# EAGLE schematic talkie_module_panel_1 (EAGLE 7.1.0)
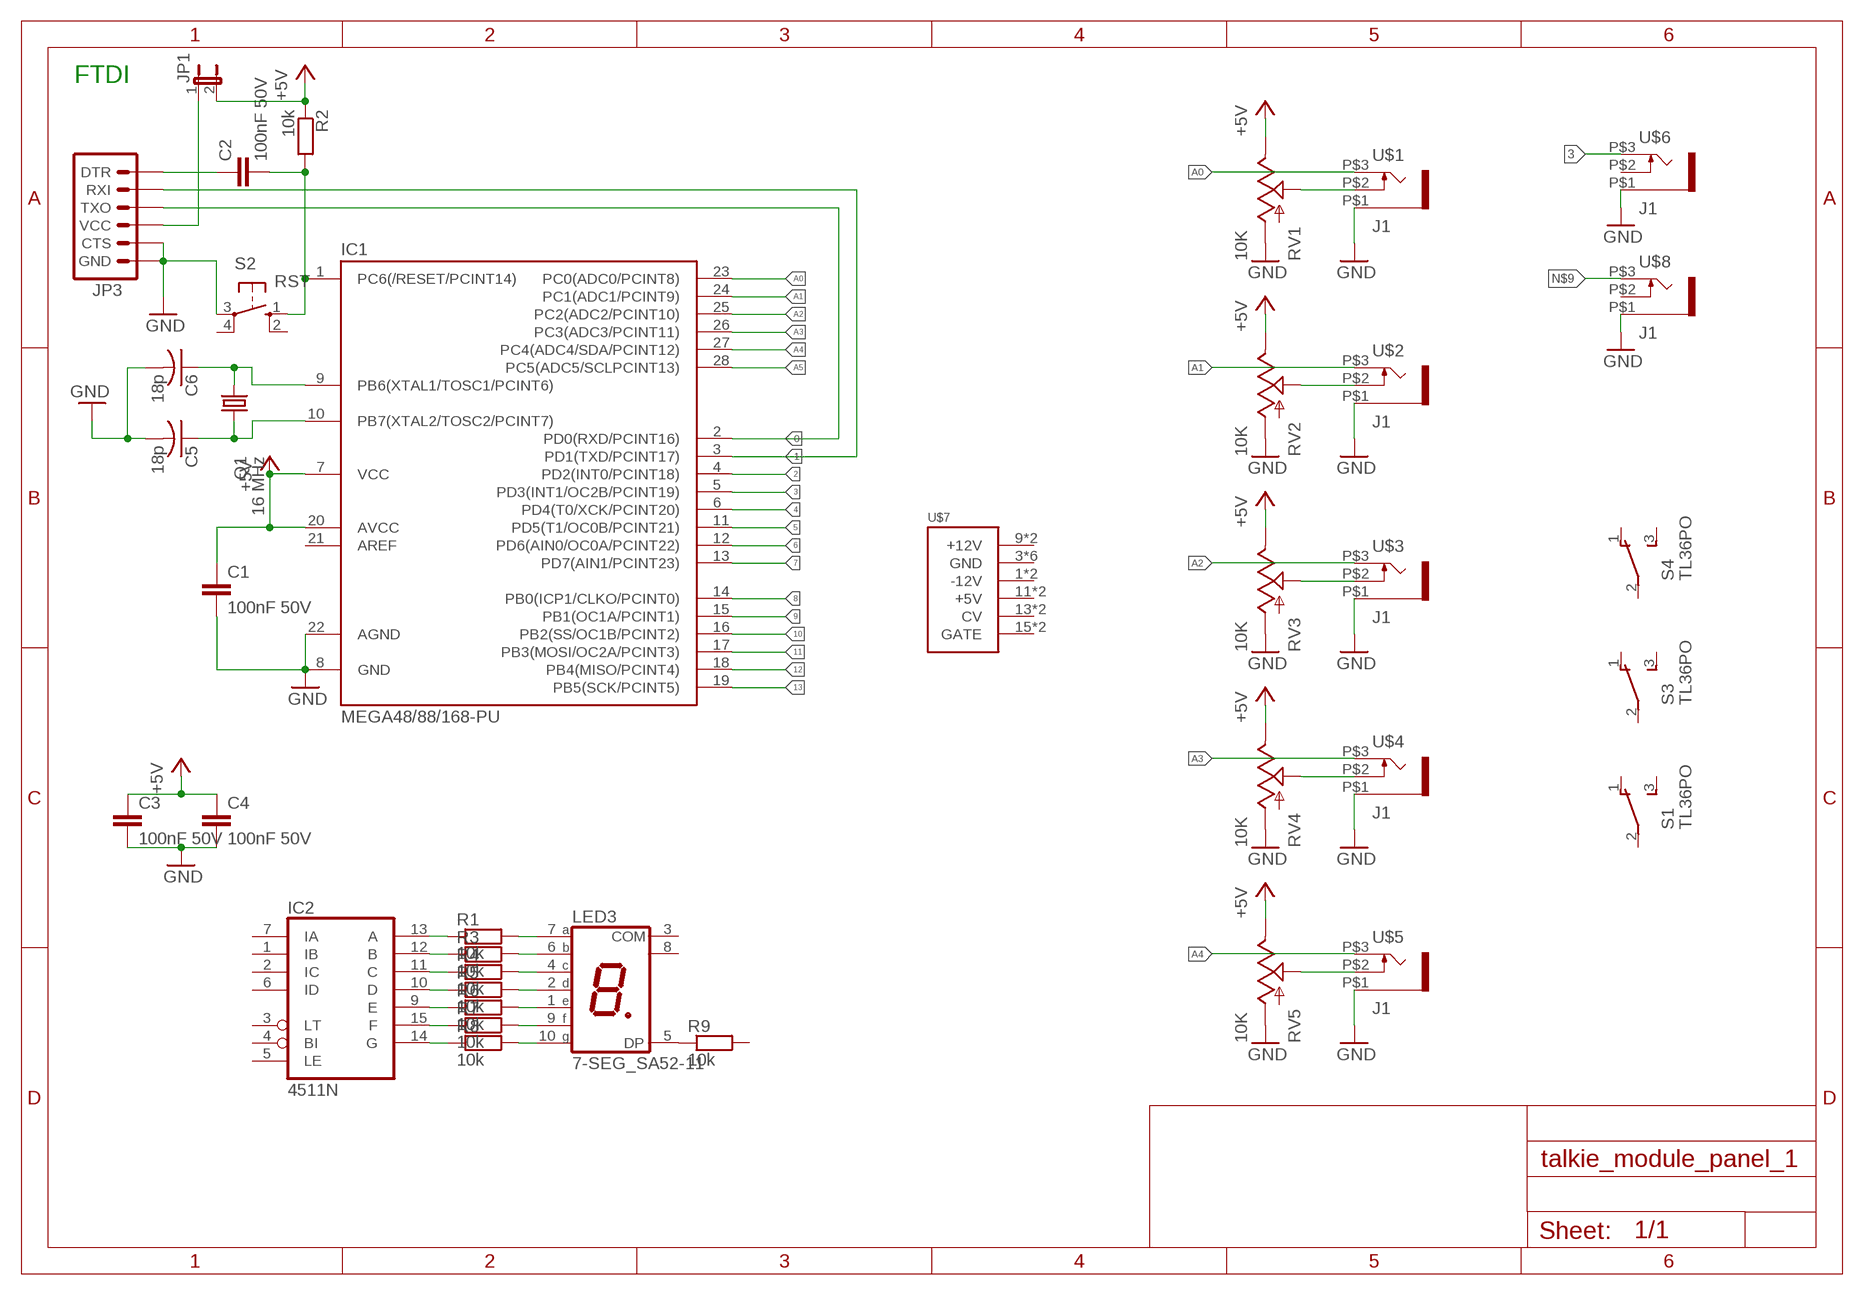
[diagram p0: schematic, sheet 1]

## Parts
C1  100nF 50V  C-EU025-025X050  [C025-025X050]
C2  100nF 50V  C-EU025-025X050  [C025-025X050]
C3  100nF 50V  C-EU025-025X050  [C025-025X050]
C4  100nF 50V  C-EU025-025X050  [C025-025X050]
C5  18p  C-US025-025X050  [C025-025X050]
C6  18p  C-US025-025X050  [C025-025X050]
IC1  MEGA48/88/168-PU  [DIL28-3]
IC2  4511N  [DIL16]
JP1  JP1E  [JP1]
JP3  ARDUINO_SERIAL_PROGRAMLOCK  [1X06_LOCK]
LED3  7-SEG_SA52-11  [SA52-11]
Q1  16 MHz  CRYSTALHC49S  [HC49/S]
R1  10k  RESISTOR  [RES-AXIAL-0.4]
R2  10k  RESISTOR  [RES-AXIAL-0.4]
R3  10k  RESISTOR  [RES-AXIAL-0.4]
R4  10k  RESISTOR  [RES-AXIAL-0.4]
R5  10k  RESISTOR  [RES-AXIAL-0.4]
R6  10k  RESISTOR  [RES-AXIAL-0.4]
R7  10k  RESISTOR  [RES-AXIAL-0.4]
R8  10k  RESISTOR  [RES-AXIAL-0.4]
R9  10k  RESISTOR  [RES-AXIAL-0.4]
RV1  10K  POT  [ALPS_POT]
RV2  10K  POT  [ALPS_POT]
RV3  10K  POT  [ALPS_POT]
RV4  10K  POT  [ALPS_POT]
RV5  10K  POT  [ALPS_POT]
S1  TL36PO  [TL3XPO]
S2  RST  10-XX  [B3F-10XX]
S3  TL36PO  [TL3XPO]
S4  TL36PO  [TL3XPO]
U$1  J1  THONKICONN  [THONKICONN]
U$2  J1  THONKICONN  [THONKICONN]
U$3  J1  THONKICONN  [THONKICONN]
U$4  J1  THONKICONN  [THONKICONN]
U$5  J1  THONKICONN  [THONKICONN]
U$6  J1  THONKICONN  [THONKICONN]
U$7  POWER  [POWER_16]
U$8  J1  THONKICONN  [THONKICONN]

## Nets
0: IC1.2(PD0(RXD/PCINT16)) JP3.3(TXO)
1: IC1.3(PD1(TXD/PCINT17)) JP3.2(RXI)
2: IC1.4(PD2(INT0/PCINT18))
3: IC1.5(PD3(INT1/OC2B/PCINT19)) U$6.P$3
4: IC1.6(PD4(T0/XCK/PCINT20))
5: IC1.11(PD5(T1/OC0B/PCINT21))
6: IC1.12(PD6(AIN0/OC0A/PCINT22))
7: IC1.13(PD7(AIN1/PCINT23))
8: IC1.14(PB0(ICP1/CLKO/PCINT0))
9: IC1.15(PB1(OC1A/PCINT1))
10: IC1.16(PB2(SS/OC1B/PCINT2))
11: IC1.17(PB3(MOSI/OC2A/PCINT3))
12: IC1.18(PB4(MISO/PCINT4))
13: IC1.19(PB5(SCK/PCINT5))
+5V [power]: C1.1 C3.1 C4.1 IC1.7(VCC) IC1.20(AVCC) JP1.2 R2.P$1 RV1.P$1(E) RV2.P$1(E) RV3.P$1(E) RV4.P$1(E) RV5.P$1(E)
A0: IC1.23(PC0(ADC0/PCINT8)) U$1.P$3
A1: IC1.24(PC1(ADC1/PCINT9)) U$2.P$3
A2: IC1.25(PC2(ADC2/PCINT10)) U$3.P$3
A3: IC1.26(PC3(ADC3/PCINT11)) U$4.P$3
A4: IC1.27(PC4(ADC4/SDA/PCINT12)) U$5.P$3
A5: IC1.28(PC5(ADC5/SCLPCINT13))
GND: C1.2 C3.2 C4.2 C5.2 C6.2 IC1.8(GND) IC1.22(AGND) JP3.5(CTS) JP3.6(GND) RV1.P$3(A) RV2.P$3(A) RV3.P$3(A) RV4.P$3(A) RV5.P$3(A) S2.3(P) U$1.P$1 U$2.P$1 U$3.P$1 U$4.P$1 U$5.P$1 U$6.P$1 U$8.P$1
N$1: RV1.P$2(S) U$1.P$2
N$2: RV2.P$2(S) U$2.P$2
N$3: C5.1 IC1.10(PB7(XTAL2/TOSC2/PCINT7)) Q1.1
N$4 [power]: JP1.1 JP3.4(VCC)
N$5: RV3.P$2(S) U$3.P$2
N$6: RV4.P$2(S) U$4.P$2
N$7: RV5.P$2(S) U$5.P$2
N$8: IC2.13(A) R1.P$1
N$9: U$8.P$3
N$10: LED3.7(A) R1.P$2
N$11: LED3.5(DP) R9.P$1
N$12: C6.1 IC1.9(PB6(XTAL1/TOSC1/PCINT6)) Q1.2
N$13: C2.2 IC1.1(PC6(/RESET/PCINT14)) R2.P$2 S2.1(S)
N$14: C2.1 JP3.1(DTR)
N$15: IC2.12(B) R3.P$1
N$16: LED3.6(B) R3.P$2
N$17: IC2.11(C) R4.P$1
N$18: LED3.4(C) R4.P$2
N$19: IC2.10(D) R5.P$1
N$20: LED3.2(D) R5.P$2
N$21: IC2.9(E) R6.P$1
N$22: LED3.1(E) R6.P$2
N$23: IC2.15(F) R7.P$1
N$24: LED3.9(F) R7.P$2
N$25: IC2.14(G) R8.P$1
N$26: LED3.10(G) R8.P$2
Unconnected: IC1.21(AREF) IC2.1(IB) IC2.2(IC) IC2.3(LT) IC2.4(BI) IC2.5(LE) IC2.6(ID) IC2.7(IA) LED3.3(COM) LED3.8(COM) R9.P$2 S1.1(O) S1.2(P) S1.3(S) S2.2(S1) S2.4(P1) S3.1(O) S3.2(P) S3.3(S) S4.1(O) S4.2(P) S4.3(S) U$6.P$2 U$7.1(-12V) U$7.2(-12V) U$7.3(GND) U$7.4(GND) U$7.5(GND) U$7.6(GND) U$7.7(GND) U$7.8(GND) U$7.9(+12V) U$7.10(+12V) U$7.11(+5V) U$7.12(+5V) U$7.13(CV) U$7.14(CV) U$7.15(GATE) U$7.16(GATE) U$8.P$2

## Notes on the sheet
- FTDI

## Power pins joined to a net without a drawn wire
VDD: IC2.16(VDD)
VSS: IC2.8(VSS)

## Library data of the parts
C1-C4 = rcl:C-EU: CAPACITOR, European symbol
C5 C6 = rcl:C-US: CAPACITOR, American symbol
IC1 = avr-7:MEGA48/88/168-PU
IC2 = 45xx:4511: BCD to 7-segment LATCH/DECODER/DRIVER
JP1 = jumper:JP1E: JUMPER
JP3 = SparkFun-Connectors:ARDUINO_SERIAL_PROGRAM: FTDI connector footprints
LED3 = display-kingbright:7-SEG_: Kingbright 14.2mm (0.56 INCH) SINGLE DIGIT NUMERIC DUISPLAY Source: SA56-11EWA(Ver1189471036.pdf; OC_FARNELL: 1168602; OC_NEWARK: unknown
Q1 = crystal:CRYSTAL: CRYSTAL
R1-R9 = SteveMarple:RESISTOR: 1/4W PTH resistor
RV1-RV5 = SparkFun-Electromechanical:POT; OC_FARNELL: 1769829
S1 S3 S4 = switch:TL36PO: TINY SWITCH ON - ON Source: http://www2.produktinfo.conrad.com/datenblaetter/700000-724999/705152-da-01-de-Subminiaturschalter_TL_36YO.pdf; OC_FARNELL: 9472967
S2 = switch-omron:10-XX: OMRON SWITCH; MPN: B3F-1000; OC_FARNELL: 176432; OC_NEWARK: 36M3542
U$1-U$6 U$8 = thonkiconn:THONKICONN
U$7 = eurorack:POWER

## Net classes
1 power: width 0.381 mm